# Altium schematic sheet Altium_Esp8266_2Relay_ICVietLife.schdoc
size 193 x 121 mm
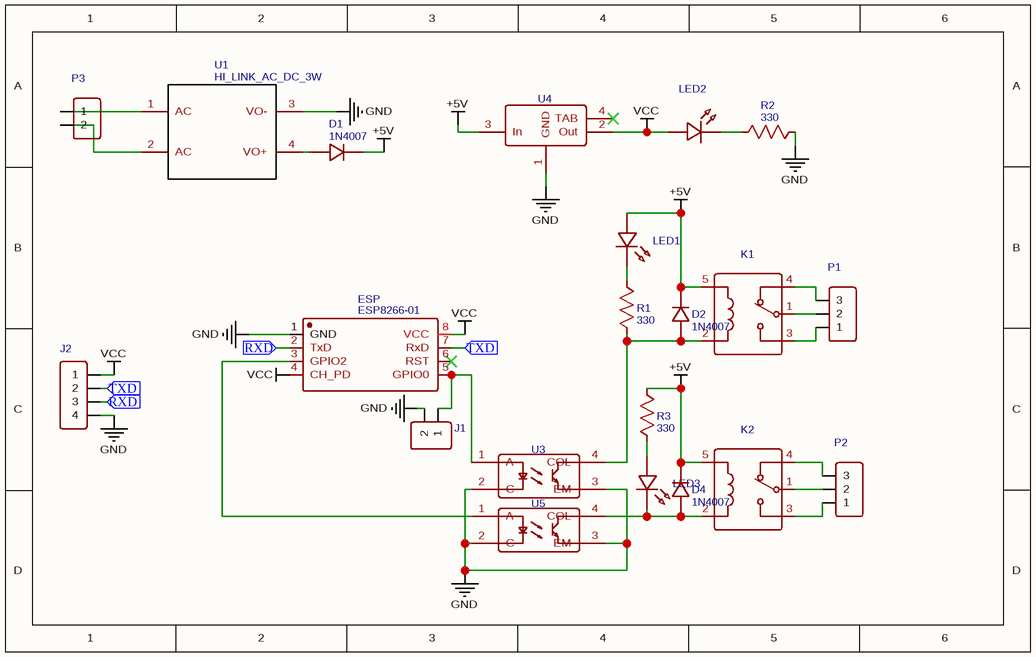
[diagram p0: Altium_Esp8266_2Relay_ICVietLife.schdoc]

## Parts
D1  1N4007  [DO-41_BD2.4-L4.7-P8.70-D0.9-RD]
D2  1N4007  [DO-41_BD2.4-L4.7-P8.70-D0.9-RD]
D4  1N4007  [DO-41_BD2.4-L4.7-P8.70-D0.9-RD]
ESP  ESP8266-01  [ESP8266-01]
J1  HDR-M-2.54_1x2  [HDR-M-2.54_1X2]  (value not drawn)
J2  HDR-M-2.54_1x4  [HDR-M-2.54_1X4]  (value not drawn)
K1  RelayHT3F-12VDC-SHG  [RELAY-TH_HT3F-DCXX-X-X]  (value not drawn)
K2  RelayHT3F-12VDC-SHG  [RELAY-TH_HT3F-DCXX-X-X]  (value not drawn)
LED1  LED-TH-3mm_R  [LED-TH_BD3.0_RED]  (value not drawn)
LED2  LED-TH-3mm_R  [LED-TH_BD3.0_RED]  (value not drawn)
LED3  LED-TH-3mm_R  [LED-TH_BD3.0_RED]  (value not drawn)
P1  CONN-TH_3P-P5.00  [CONN-TH_3P-P5.00]  (value not drawn)
P2  CONN-TH_3P-P5.00  [CONN-TH_3P-P5.00]  (value not drawn)
P3  CONN-TH_2P-P5.00  [CONN-TH_2P-P5.00]  (value not drawn)
R1  330  [R_AXIAL-0.3]
R2  330  [R_AXIAL-0.3]
R3  330  [R_AXIAL-0.3]
U1  HI_LINK_AC_DC_3W  [HI LINK AC TO DC]
U3  PC817C_C558562  [DIP-4_L4.6-W6.5-P2.54-LS7.6-BL]  (value not drawn)
U4  AMS1117-1.5_C166063  [SOT-223_L6.5-W3.5-P2.30-LS7.0-BR]  (value not drawn)
U5  PC817C_C558562  [DIP-4_L4.6-W6.5-P2.54-LS7.6-BL]  (value not drawn)

## Ports
RXD (in), TXD (in)

## Nets
+5V: D1.1 D2.1 D4.1 K1.5 K2.5 LED1.1 R3.1 U4.3(In)
GND: ESP.1(GND) J1.2 J2.4 R2.2 U1.3(VO-) U3.2(C) U3.3(EM) U4.1(GND) U5.2(C) U5.3(EM)
VCC: ESP.4(CH_PD) ESP.8(VCC) J2.1 LED2.1 U4.2(Out)
RXD: ESP.2(TxD) J2.3 ; port RXD
TXD: ESP.7(RxD) J2.2 ; port TXD
NetD1_2: D1.2 U1.4(VO+)
NetD2_2: D2.2 K1.2 R1.2 U3.4(COL)
NetD4_2: D4.2 K2.2 LED3.2 U5.4(COL)
NetESP_3: ESP.3(GPIO2) U5.1(A)
NetESP_5: ESP.5(GPIO0) J1.1 U3.1(A)
NetK1_1: K1.1 P1.2
NetK1_3: K1.3 P1.1
NetK1_4: K1.4 P1.3
NetK2_1: K2.1 P2.2
NetK2_3: K2.3 P2.1
NetK2_4: K2.4 P2.3
NetLED1_2: LED1.2 R1.1
NetLED2_2: LED2.2 R2.1
NetLED3_1: LED3.1 R3.2
NetP3_1: P3.1 U1.1(AC)
NetP3_2: P3.2 U1.2(AC)

Not connected (* = marked no-connect by the designer): ESP 6(RST)*; U4 4(TAB)*

## Library data of the parts
D1 D2 D4 = 1N4007: BOM_Manufacturer: SEMTECH; Contributor: LCEDA_Lib; BOM_Supplier: LCSC; BOM_Manufacturer Part: 1N4007; BOM_Supplier Part: C106903; spicePre: D; spiceSymbolName: 1N4007
J1 = HDR-M-2.54_1x2: Contributor: LCEDA_Lib; BOM_Supplier Part: C124375; BOM_Supplier: LCSC; spicePre: J; spiceSymbolName: HDR-M-2.54_1x2
J2 = HDR-M-2.54_1x4: Contributor: LCEDA_Lib; BOM_Supplier Part: C124378; BOM_Supplier: LCSC; spicePre: J; spiceSymbolName: HDR-M-2.54_1x4
K1 K2 = RelayHT3F-12VDC-SHG: BOM_Manufacturer: HTV; SMT Type: Extend; BOM_Paste Type: expand; BOM_Supplier: LCSC; BOM_Manufacturer Part: RelayHT3F-12VDC-SHG; image: //image.lceda.cn/szlcsc/C22022.jpg; BOM_Supplier Part: C22022; BOM_LCSC Assembly: Yes; spicePre: K; spiceSymbolName: RelayHT3F-12VDC-SHG
LED1-LED3 = LED-TH-3mm_R: BOM_Manufacturer: EVERLIGHT(台湾亿光); BOM_Manufacturer Part: 204-10SDRD/S530-A3-L; Contributor: LCEDA_Lib; BOM_Supplier Part: C84774; BOM_Supplier: LCSC; spicePre: L; spiceSymbolName: LED-TH-3mm_R
P1 P2 = CONN-TH_3P-P5.00: Contributor: LCEDA_Lib; BOM_Supplier: LCSC; spicePre: P; spiceSymbolName: CONN-TH_3P-P5.00
P3 = CONN-TH_2P-P5.00: Contributor: LCEDA_Lib; BOM_Supplier: LCSC; spicePre: P; spiceSymbolName: CONN-TH_2P-P5.00
R1-R3 = 330: nameAlias: Value(Ω); Contributor: LCEDA_Lib; spicePre: R; spiceSymbolName: R_AXIAL-0.3_US
U1 = HI_LINK_AC_DC_3W: BOM_Manufacturer Part: HI LINK; Contributor: sascha23095123423; spicePre: U; spiceSymbolName: HI_LINK_AC_DC_3W
U3 U5 = PC817C_C558562: BOM_Manufacturer: MICRONE(Nanjing Micro One Elec); BOM_Manufacturer Part: PC817C; Contributor: LCSC; SMT Type: Extend; BOM_Paste Type: expand; BOM_Supplier: LCSC; BOM_Supplier Part: C558562; BOM_LCSC Assembly: Yes; spicePre: U; spiceSymbolName: PC817C_C558562
U4 = AMS1117-1.5_C166063: BOM_Manufacturer: SK; Contributor: LCSC; SMT Type: Extend; BOM_Paste Type: expand; BOM_Supplier: LCSC; BOM_Supplier Part: C166063; BOM_Manufacturer Part: AMS1117-1.5; BOM_JLCPCB SMD: Yes; BOM_LCSC Assembly: Yes; spicePre: U; spiceSymbolName: AMS1117-1.5_C166063
ESP = ESP8266-01: spicePre: X; BOM_Supplier Part: https://www.banggood.com/Upgraded-Version-1M-Flash-ESP8266-ESP-01-WIFI-Transceiver-Wireless-Module-p-979509.html?rmmds=detail-top-buytogether; BOM_Supplier: Banggood; spiceSymbolName: ESP8266-01